# Altium schematic sheet Sim900.SchDoc
size A4
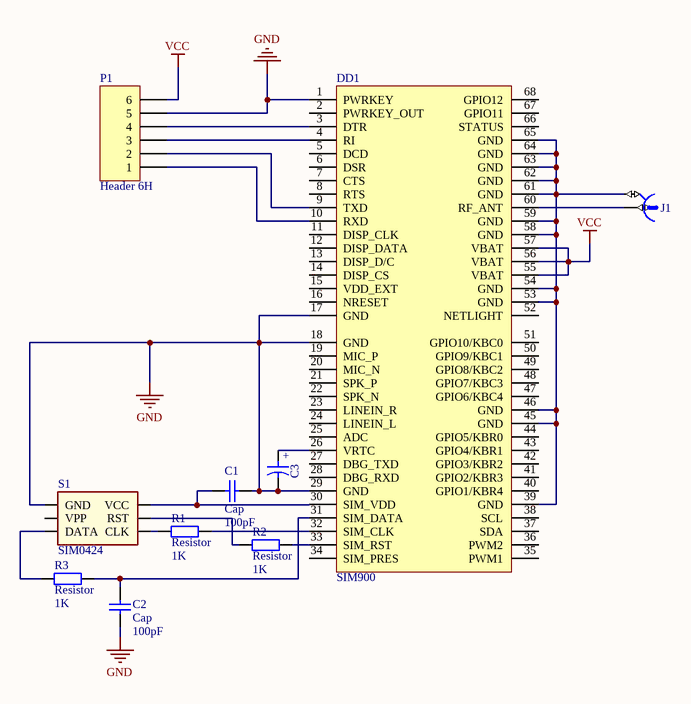
[diagram p0: Sim900.SchDoc]

## Parts
C1  Cap  value 100pF  [CAPC(0805)2012X07N]
C2  Cap  value 100pF  [CAPC(0805)2012X07N]
C3  10uF  [CAPMP7343X310N]  (value not drawn)
DD1  SIM900  [SIM900]
J1  U.FL  [HIROSE_U.FL-R-SMT-1(10)]  (value not drawn)
P1  Header 6H  [HDR1X6H]
R1  Resistor  value 1K  [RESC(0805)2112X05N]
R2  Resistor  value 1K  [RESC(0805)2112X05N]
R3  Resistor  value 1K  [RESC(0805)2112X05N]
S1  SIM0424  [SIM0424]

## Nets
GND: C1.2 C2.1 C3.2 DD1.1(PWRKEY) DD1.17(GND) DD1.18(GND) DD1.29(GND) P1.5 S1.4(GND)
VCC: DD1.55(VBAT) DD1.56(VBAT) DD1.57(VBAT) P1.6
NetC1_1: C1.1 DD1.30(SIM_VDD) S1.1(VCC)
NetC2_2: C2.2 DD1.31(SIM_DATA) R3.2
NetC3_1: C3.1 DD1.26(VRTC)
NetDD1_3: DD1.3(DTR) P1.4
NetDD1_4: DD1.4(RI) P1.3
NetDD1_9: DD1.9(TXD) P1.2
NetDD1_10: DD1.10(RXD) P1.1
NetDD1_32: DD1.32(SIM_CLK) R1.2
NetDD1_33: DD1.33(SIM_RST) R2.2
NetDD1_39: DD1.39(GND) DD1.45(GND) DD1.46(GND) DD1.53(GND) DD1.54(GND) DD1.58(GND) DD1.59(GND) DD1.61(GND) DD1.62(GND) DD1.63(GND) DD1.64(GND) DD1.65(GND) J1.2
NetDD1_60: DD1.60(RF_ANT) J1.1
NetR1_1: R1.1 S1.3(CLK)
NetR2_1: R2.1 S1.2(RST)
NetR3_1: R3.1 S1.6(DATA)

Not connected (* = marked no-connect by the designer): DD1 2(PWRKEY_OUT) 5(DCD) 6(DSR) 7(CTS) 8(RTS) 11(DISP_CLK) 12(DISP_DATA) 13(DISP_D/C) 14(DISP_CS) 15(VDD_EXT) 16(NRESET) 19(MIC_P) 20(MIC_N) 21(SPK_P) 22(SPK_N) 23(LINEIN_R) 24(LINEIN_L) 25(ADC) 27(DBG_TXD) 28(DBG_RXD) 34(SIM_PRES) 35(PWM1) 36(PWM2) 37(SDA) 38(SCL) 40(GPIO1/KBR4) 41(GPIO2/KBR3) 42(GPIO3/KBR2) 43(GPIO4/KBR1) 44(GPIO5/KBR0) 47(GPIO6/KBC4) 48(GPIO7/KBC3) 49(GPIO8/KBC2) 50(GPIO9/KBC1) 51(GPIO10/KBC0) 52(NETLIGHT) 66(STATUS) 67(GPIO11) 68(GPIO12); S1 5(VPP)

## Notes on the sheet
- (in symbol CTE7343-31_10UF_25V_10%) +

## Library data of the parts
C1 C2 = Cap: Capacitor
C3 = CTE7343-31_10UF_25V_10%: Polarised capacitor; Part Description: Solid Tantalum Chip Capacitor; Manufacturer: GENERIC; Manufacturer1 Part Number: TAJD106K025R; Voltage: 25V; Tolerance: ±10%; Table: Capacitors SMD; Part Number: CTE7343-31_10UF_25V_10%; Component Kind: Standard; Component Type: Standard; Pin Count: 2; Value: 10uF; Status: Preferred; Manufacturer Part Number: CTE7343-31_10UF_25V_10%; Case: D; Mounted: Yes; Socket: No; SMD: Yes; Manufacturer1 Example: AVX; Manufacturer1 ComponentHeight: 3.1mm; HelpURL: \\cern.ch\dfs\Applications\Altium\Datasheets\CTE_AVX_TAJ.pdf; Author: CERN DEM JMW; CreateDate: 17.10.2008; LatestRevisionDate: 17.10.2008
DD1 = SIM900: GSM/GPRS module SIM900; Autor: Yanichar http://zeroelectronics.ru/autor; Order: SIM900; Value: SIM900
J1 = HIROSE_U.FL-R-SMT-1(10): Part Description: Up to 6GHz Ultra Small Surface Mount Male Coaxial Connectors U.FL Series; Manufacturer: HIROSE (HRS); Table: Miscellaneous; Part Number: HIROSE_U.FL-R-SMT-1(10); Component Kind: Standard; Component Type: Standard; Pin Count: 2; Family: U.FL; Mounted: Yes; Socket: No; SMD: Yes; Status: None; Manufacturer Part Number: U.FL-R-SMT-1(10); ComponentHeight: 1.25mm; HelpURL: \\cern.ch\dfs\Applications\Altium\Datasheets\HIROSE_U.FL-R-SMT-1(10).pdf; Author: CERN DEM JLC; CreateDate: 24.03.2010; LatestRevisionDate: 24.03.2010
P1 = Header 6H: Header, 6-Pin, Right Angle; LatestRevisionDate: 17-Jul-2002; LatestRevisionNote: Re-released for DXP Platform.; Publisher: Altium Limited
S1 = SIM0424: Sim Socket SIM0424; DataSheet: http://www.farnell.com/datasheets/1796466.pdf